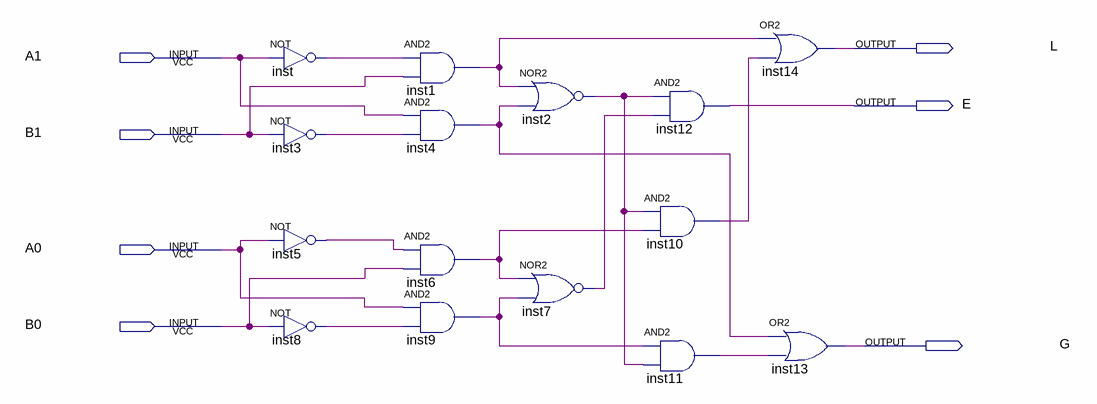
[diagram p0: schematic sheet]
// Quartus schematic Question3.bdf as structural Verilog: 15 symbols, 7 pins
module Question3 (
  input  A1,
  input  B1,
  input  A0,
  input  B0,
  output L,
  output E,
  output G
);

  wire inst1_out, inst2_out, inst3_out, inst4_out, inst5_out, inst6_out, inst7_out, inst8_out, inst9_out,
       inst10_out, inst11_out, inst_out;

  not inst (inst_out, A1);
  not inst3 (inst3_out, B1);
  not inst5 (inst5_out, A0);
  not inst8 (inst8_out, B0);
  and inst1 (inst1_out, inst_out, B1);
  and inst4 (inst4_out, A1, inst3_out);
  and inst6 (inst6_out, inst5_out, B0);
  and inst9 (inst9_out, A0, inst8_out);
  nor inst2 (inst2_out, inst1_out, inst4_out);
  nor inst7 (inst7_out, inst6_out, inst9_out);
  and inst12 (E, inst2_out, inst7_out);
  and inst10 (inst10_out, inst2_out, inst6_out);
  and inst11 (inst11_out, inst9_out, inst2_out);
  or inst14 (L, inst1_out, inst10_out);
  or inst13 (G, inst4_out, inst11_out);
endmodule
